# EAGLE schematic HoverBoard_SCHEMATIC_for_TAOTAO TT-SD2.2 (EAGLE 9.3.2)

## Sheet 1 of 4
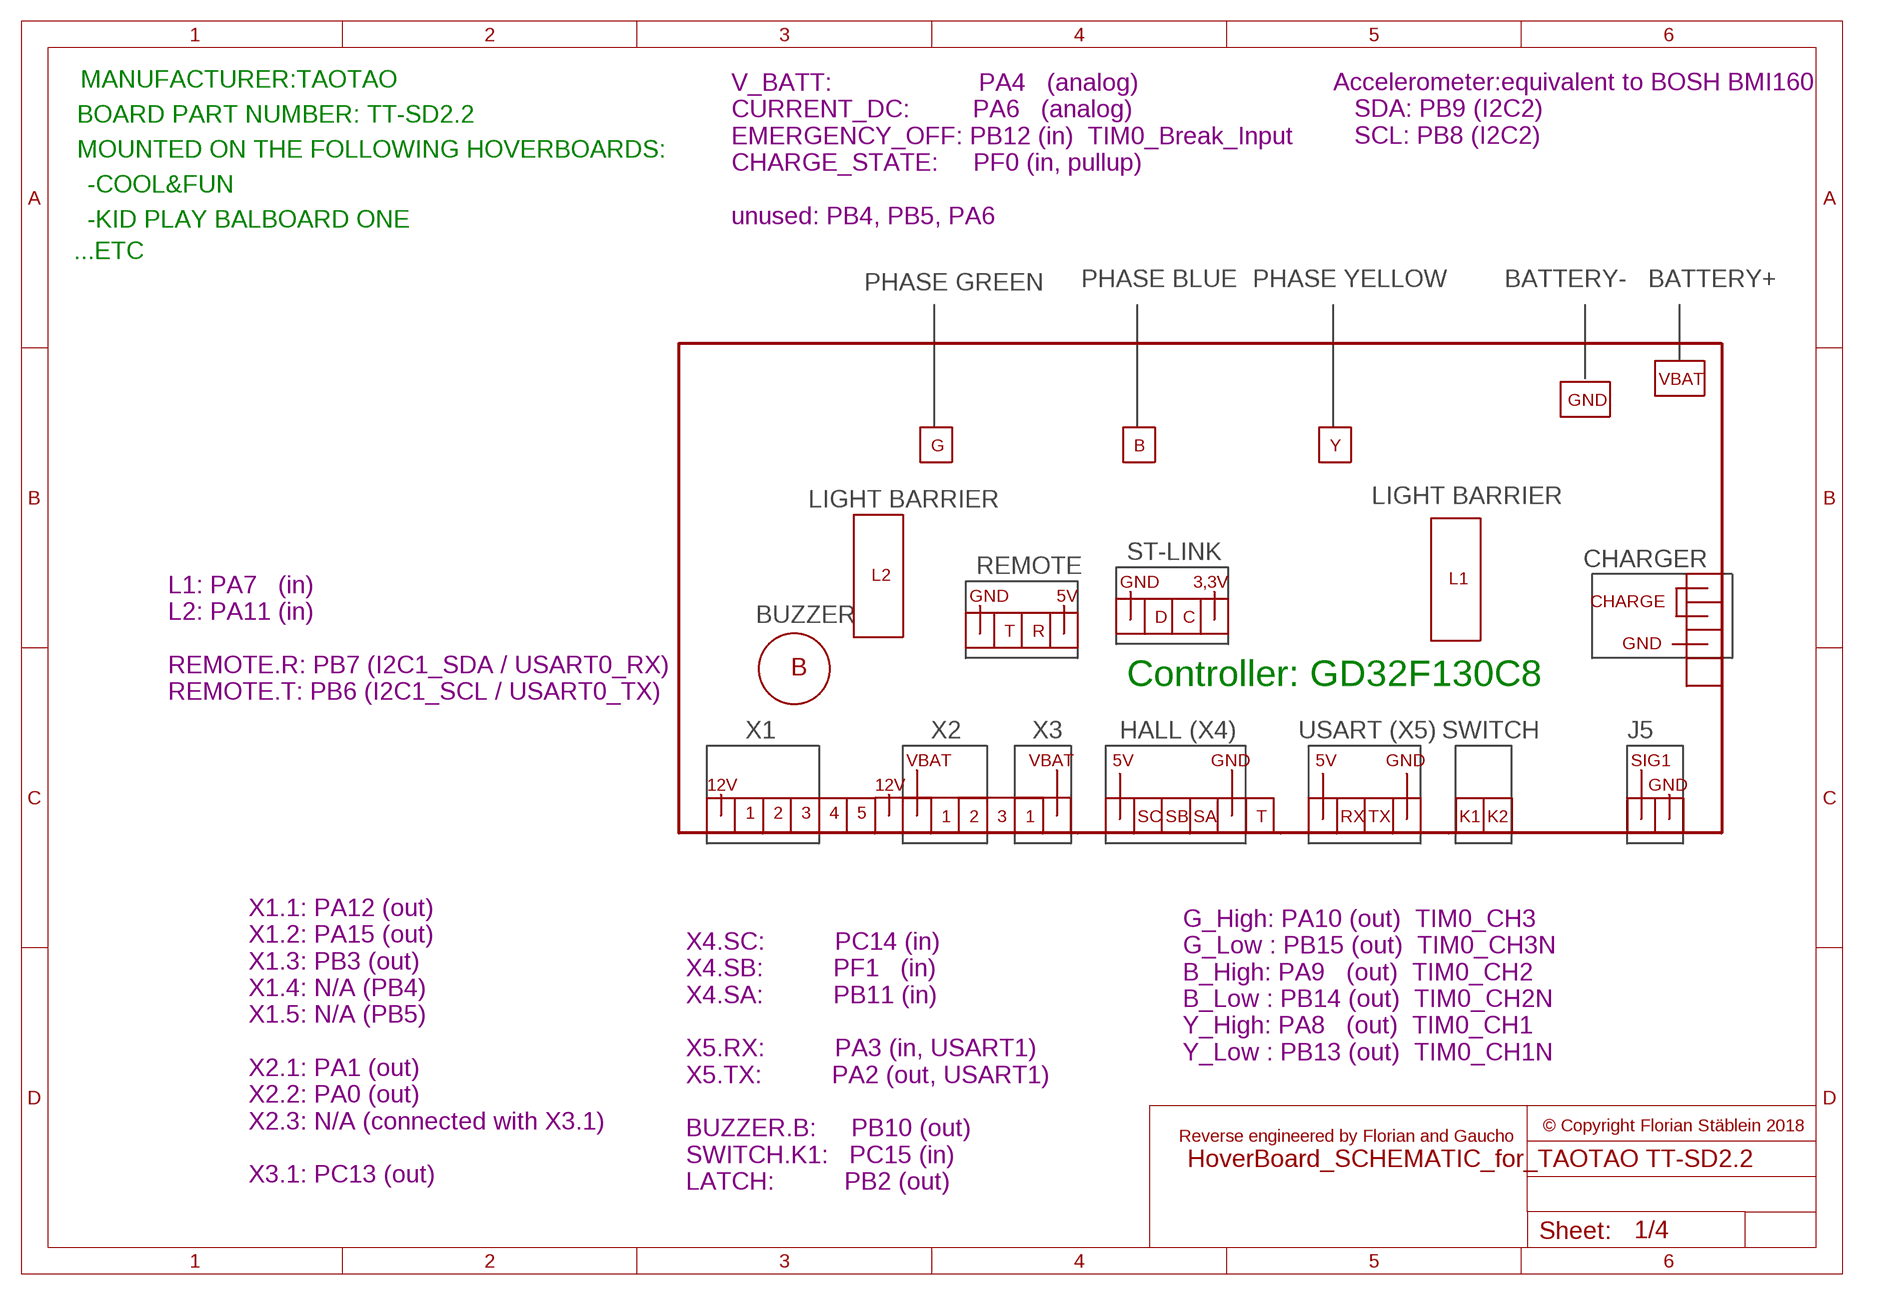
[diagram p0: schematic, sheet 1]

### Notes on the sheet
- MANUFACTURER:TAOTAO
- BOARD PART NUMBER: TT-SD2.2
- Accelerometer:equivalent to BOSH BMI160
     SDA: PB9 (I2C2)
     SCL: PB8 (I2C2)
- MOUNTED ON THE FOLLOWING HOVERBOARDS:
- -COOL&FUN
- V_BATT:                     PA4   (analog)
  CURRENT_DC:         PA6   (analog)
  EMERGENCY_OFF: PB12 (in)  TIM0_Break_Input
  CHARGE_STATE:     PF0 (in, pullup)
  
  unused: PB4, PB5, PA6
- -KID PLAY BALBOARD ONE
- ...ETC
- PHASE GREEN | PHASE BLUE | PHASE YELLOW | BATTERY- | BATTERY+
- VBAT
- GND
- G | B | Y
- LIGHT BARRIER | LIGHT BARRIER
- CHARGER
- ST-LINK
- REMOTE
- L2 | L1
- GND | 3,3V
- CHARGE
- GND | 5V
- BUZZER | D | C
- T | R | GND
- B
- Controller: GD32F130C8
- L1: PA7   (in)
  L2: PA11 (in)
  
  REMOTE.R: PB7 (I2C1_SDA / USART0_RX)
  REMOTE.T: PB6 (I2C1_SCL / USART0_TX)
- X1 | X2 | X3 | HALL (X4) | USART (X5) | SWITCH | J5
- VBAT | VBAT | 5V | GND | 5V | GND | SIG1
- 12V | 12V | GND
- 1 | 2 | 3 | 4 | 5 | 1 | 2 | 3 | 1 | SC | SB | SA | T | RX | TX | K1 | K2
- G_High: PA10 (out)  TIM0_CH3
  G_Low : PB15 (out)  TIM0_CH3N
  B_High: PA9   (out)  TIM0_CH2
  B_Low : PB14 (out)  TIM0_CH2N
  Y_High: PA8   (out)  TIM0_CH1
  Y_Low : PB13 (out)  TIM0_CH1N
- © Copyright Florian Stäblein 2018
- Reverse engineered by Florian and Gaucho
- X1.1: PA12 (out)
  X1.2: PA15 (out)
  X1.3: PB3 (out)
  X1.4: N/A (PB4)
  X1.5: N/A (PB5)
  
  X2.1: PA1 (out)
  X2.2: PA0 (out)
  X2.3: N/A (connected with X3.1)
  
  X3.1: PC13 (out)
- X4.SC:          PC14 (in)
  X4.SB:          PF1   (in)
  X4.SA:          PB11 (in)
  
  X5.RX:          PA3 (in, USART1)
  X5.TX:          PA2 (out, USART1)
  
  BUZZER.B:     PB10 (out)
  SWITCH.K1:   PC15 (in)
  LATCH:          PB2 (out)

## Sheet 2 of 4
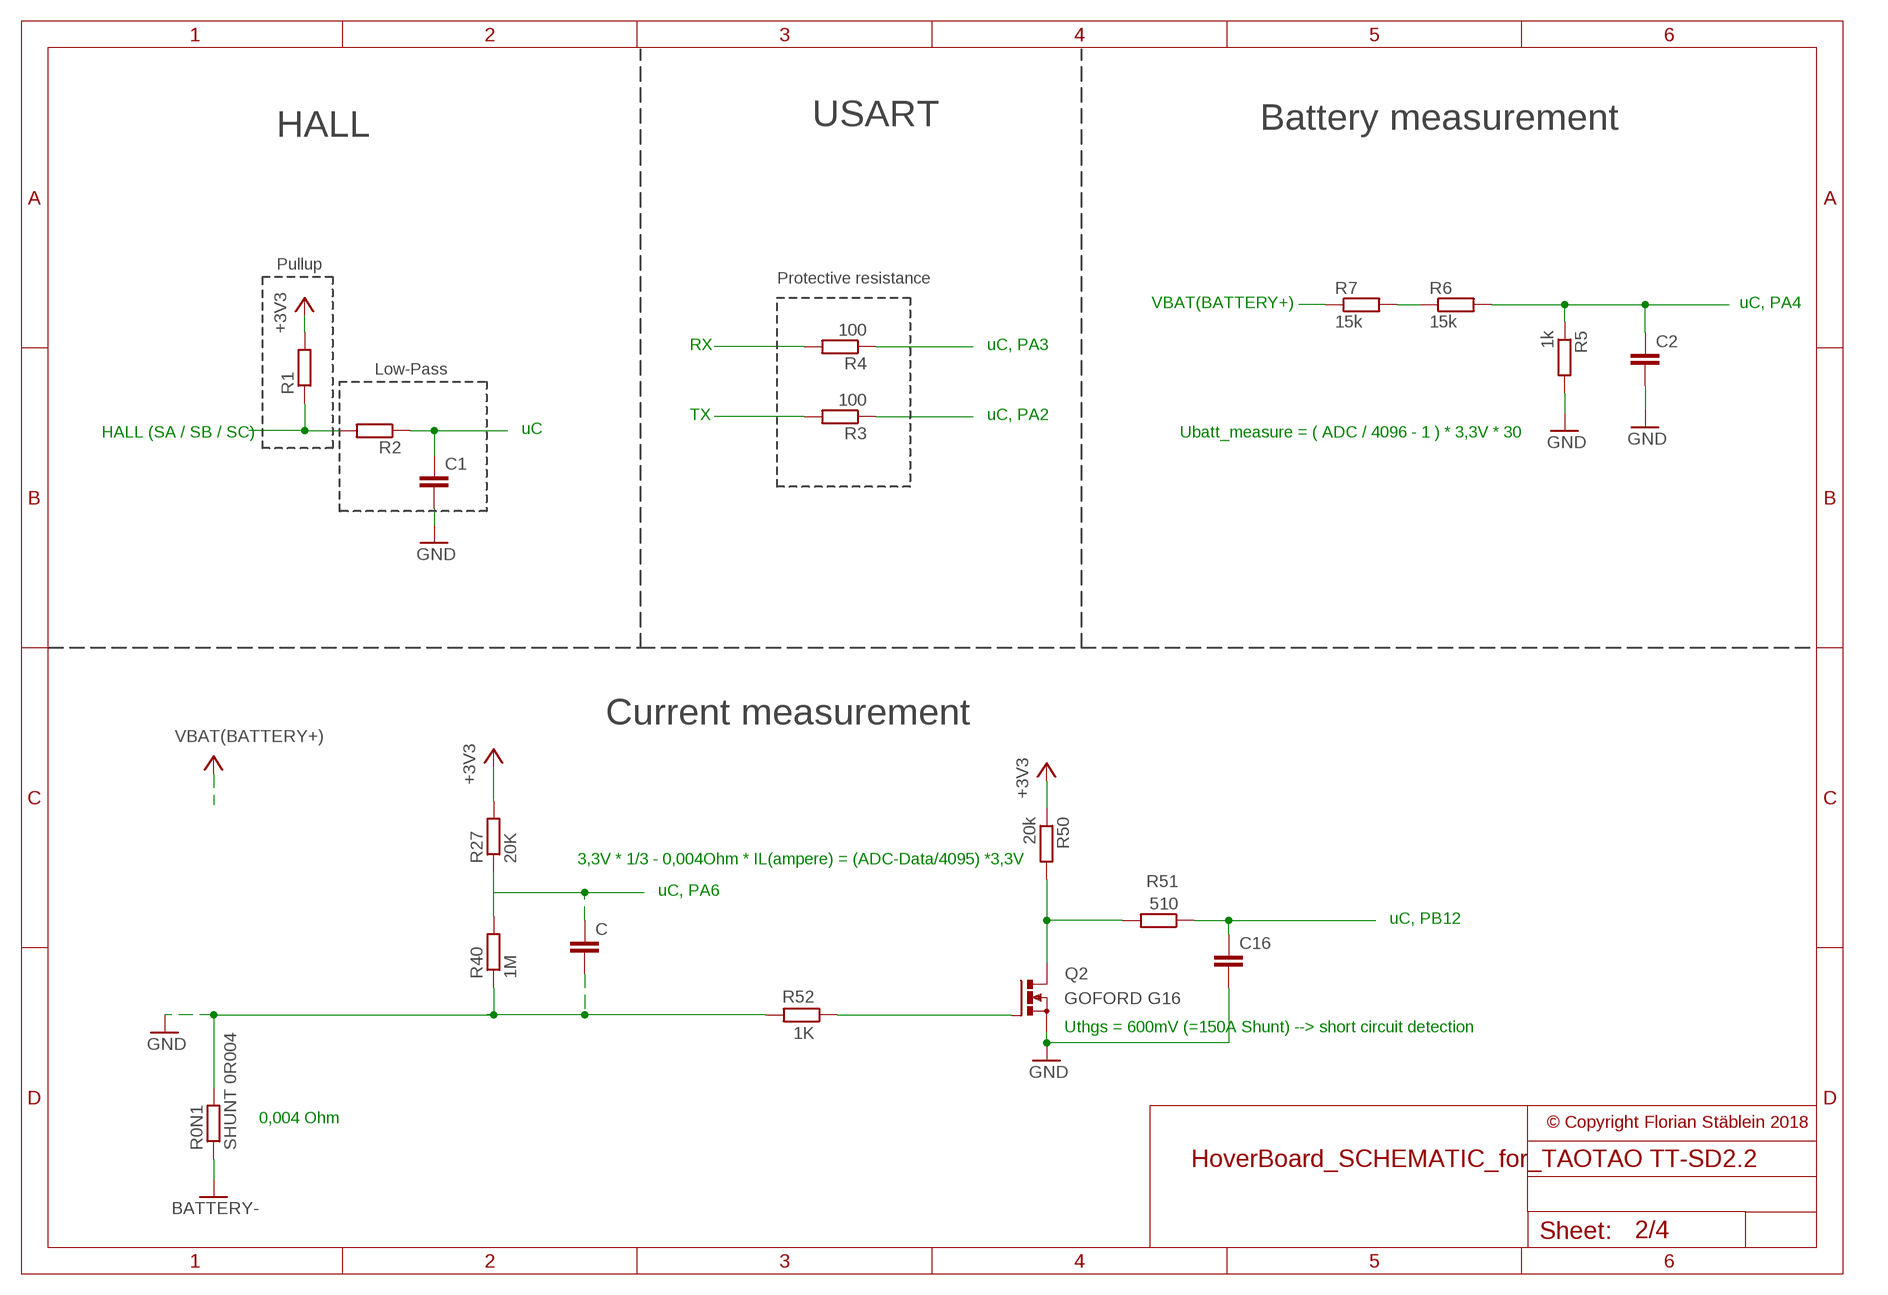
[diagram p1: schematic, sheet 2]
Q2 (N-MOSFET_SYMBOL): MDOEL: GOFORD G16

### Parts
C  C-EU025-025X050  [C025-025X050]
C1  C-EU025-025X050  [C025-025X050]
C2  C-EU025-025X050  [C025-025X050]
C16  C-EU025-025X050  [C025-025X050]
R0N1  SHUNT 0R004  R-EU_0207/2V  [0207/2V]
R1  R-EU_0207/2V  [0207/2V]
R2  R-EU_0207/2V  [0207/2V]
R3  100  R-EU_0207/2V  [0207/2V]
R4  100  R-EU_0207/2V  [0207/2V]
R5  1k  R-EU_0207/2V  [0207/2V]
R6  15k  R-EU_0207/2V  [0207/2V]
R7  15k  R-EU_0207/2V  [0207/2V]
R27  20K  R-EU_0207/2V  [0207/2V]
R40  1M  R-EU_0207/2V  [0207/2V]
R50  20k  R-EU_0207/2V  [0207/2V]
R51  510  R-EU_0207/2V  [0207/2V]
R52  1K  R-EU_0207/2V  [0207/2V]

### Nets
+3V3: R1.2 R27.2 R50.1 ; also sheet 3,4
GND: C1.2 C2.2 C16.2 R0N1.1 R0N1.2 R5.2 R40.1 ; also sheet 3,4
N$1: R1.1 R2.2
N$2: C1.1 R2.1
N$3: R4.2
N$4: R4.1
N$5: R3.2
N$6: R3.1
N$7: R7.1
N$8: R6.1 R7.2
N$9: C2.1 R5.1 R6.2
N$10: C.2 R52.2
N$12: R50.2 R51.2
N$13: C16.1 R51.1
N$48: R40.2
N$49: C.1 R27.1
N$62: R52.1

### Notes on the sheet
- HALL | USART | Battery measurement
- Pullup
- Protective resistance
- VBAT(BATTERY+) | uC, PA4
- RX | uC, PA3
- Low-Pass
- TX | uC, PA2
- HALL (SA / SB / SC) | uC | Ubatt_measure = ( ADC / 4096 - 1 ) * 3,3V * 30
- Current measurement
- 3,3V * 1/3 - 0,004Ohm * IL(ampere) = (ADC-Data/4095) *3,3V
- uC, PA6
- uC, PB12
- Uthgs = 600mV (=150A Shunt) --> short circuit detection
- 0,004 Ohm
- © Copyright Florian Stäblein 2018

## Sheet 3 of 4
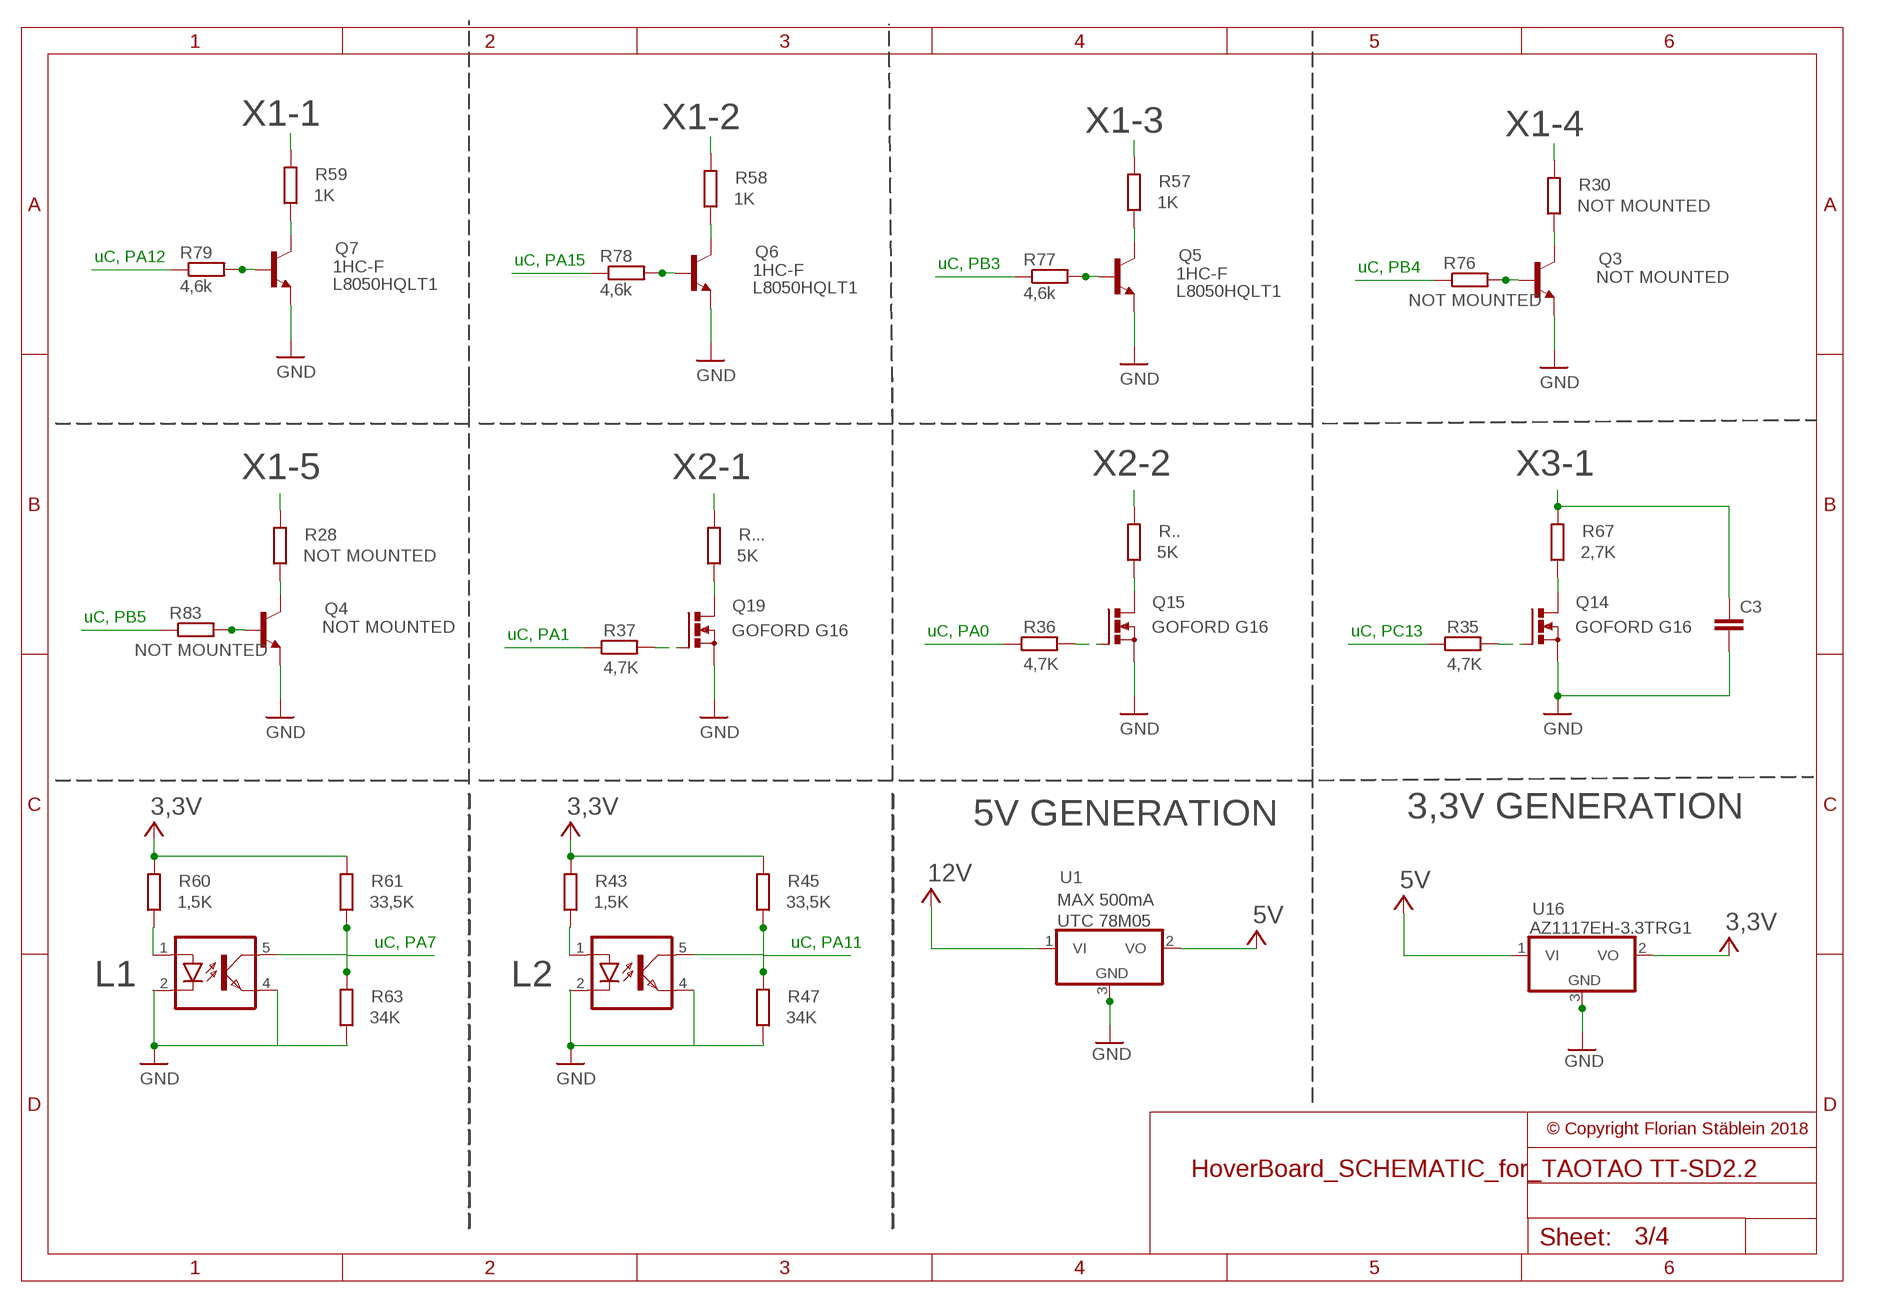
[diagram p2: schematic, sheet 3]
Q14 (N-MOSFET_SYMBOL): MDOEL: GOFORD G16
Q15 (N-MOSFET_SYMBOL): MDOEL: GOFORD G16
Q19 (N-MOSFET_SYMBOL): MDOEL: GOFORD G16

### Parts
C3  C-EU025-025X050  [C025-025X050]
L  CNY17F  [DIL06]
L1  CNY17F  [DIL06]
Q3  BC849  [SOT23]
Q4  BC849  [SOT23]
Q5  BC849  [SOT23]
Q6  BC849  [SOT23]
Q7  BC849  [SOT23]
R28  NOT MOUNTED  R-EU_0207/2V  [0207/2V]
R30  NOT MOUNTED  R-EU_0207/2V  [0207/2V]
R35  4,7K  R-EU_0207/2V  [0207/2V]
R36  4,7K  R-EU_0207/2V  [0207/2V]
R37  4,7K  R-EU_0207/2V  [0207/2V]
R43  1,5K  R-EU_0207/2V  [0207/2V]
R45  33,5K  R-EU_0207/2V  [0207/2V]
R47  34K  R-EU_0207/2V  [0207/2V]
R57  1K  R-EU_0207/2V  [0207/2V]
R58  1K  R-EU_0207/2V  [0207/2V]
R59  1K  R-EU_0207/2V  [0207/2V]
R60  1,5K  R-EU_0207/2V  [0207/2V]
R61  33,5K  R-EU_0207/2V  [0207/2V]
R63  34K  R-EU_0207/2V  [0207/2V]
R67  2,7K  R-EU_0207/2V  [0207/2V]
R76  NOT MOUNTED  R-EU_0207/2V  [0207/2V]
R77  4,6k  R-EU_0207/2V  [0207/2V]
R78  4,6k  R-EU_0207/2V  [0207/2V]
R79  4,6k  R-EU_0207/2V  [0207/2V]
R83  NOT MOUNTED  R-EU_0207/2V  [0207/2V]
R..  5K  R-EU_0207/2V  [0207/2V]
R...  5K  R-EU_0207/2V  [0207/2V]
U1  7805DT  [TO252]
U16  7805DT  [TO252]

### Nets
+3V3: R43.2 R45.2 R60.2 R61.2 U1.1(VI) U1.2(VO) U16.1(VI) U16.2(VO) ; also sheet 2,4
GND: C3.2 L1.2(C) L1.4(EMIT) L.2(C) L.4(EMIT) R47.1 R63.1 U1.3(GND) U16.3(GND) ; also sheet 2,4
N$11: R....1
N$14: R59.1
N$15: R79.1
N$16: R58.1
N$17: Q6.1(B) R78.2
N$18: R78.1
N$19: R57.1
N$20: L.1(A) R60.1
N$21: R59.2
N$22: R58.2
N$23: Q7.1(B) R79.2
N$24: Q5.1(B) R77.2
N$25: R77.1
N$26: R30.1
N$27: Q3.1(B) R76.2
N$28: R76.1
N$29: R28.1
N$30: Q4.1(B) R83.2
N$31: R83.1
N$32: R57.2
N$33: R30.2
N$34: R28.2
N$35: L.5(COL) R61.1 R63.2
N$36: L1.1(A) R43.1
N$37: L1.5(COL) R45.1 R47.2
N$50: R37.2
N$51: R37.1
N$52: R....2
N$53: R...1
N$54: R...2
N$55: R36.1
N$56: R36.2
N$57: R67.1
N$58: C3.1 R67.2
N$59: R35.1
N$60: R35.2
Unconnected: Q3.2(E) Q3.3(C) Q4.2(E) Q4.3(C) Q5.2(E) Q5.3(C) Q6.2(E) Q6.3(C) Q7.2(E) Q7.3(C)

### Notes on the sheet
- X1-1 | X1-2 | X1-3 | X1-4
- uC, PA12 | uC, PA15
- uC, PB3 | uC, PB4
- X1-5 | X2-1 | X2-2 | X3-1
- uC, PB5
- uC, PA1 | uC, PA0 | uC, PC13
- 3,3V | 3,3V | 3,3V GENERATION
- 5V GENERATION
- 12V | 5V
- 5V | 3,3V
- uC, PA7 | uC, PA11
- L1 | L2
- © Copyright Florian Stäblein 2018

## Sheet 4 of 4
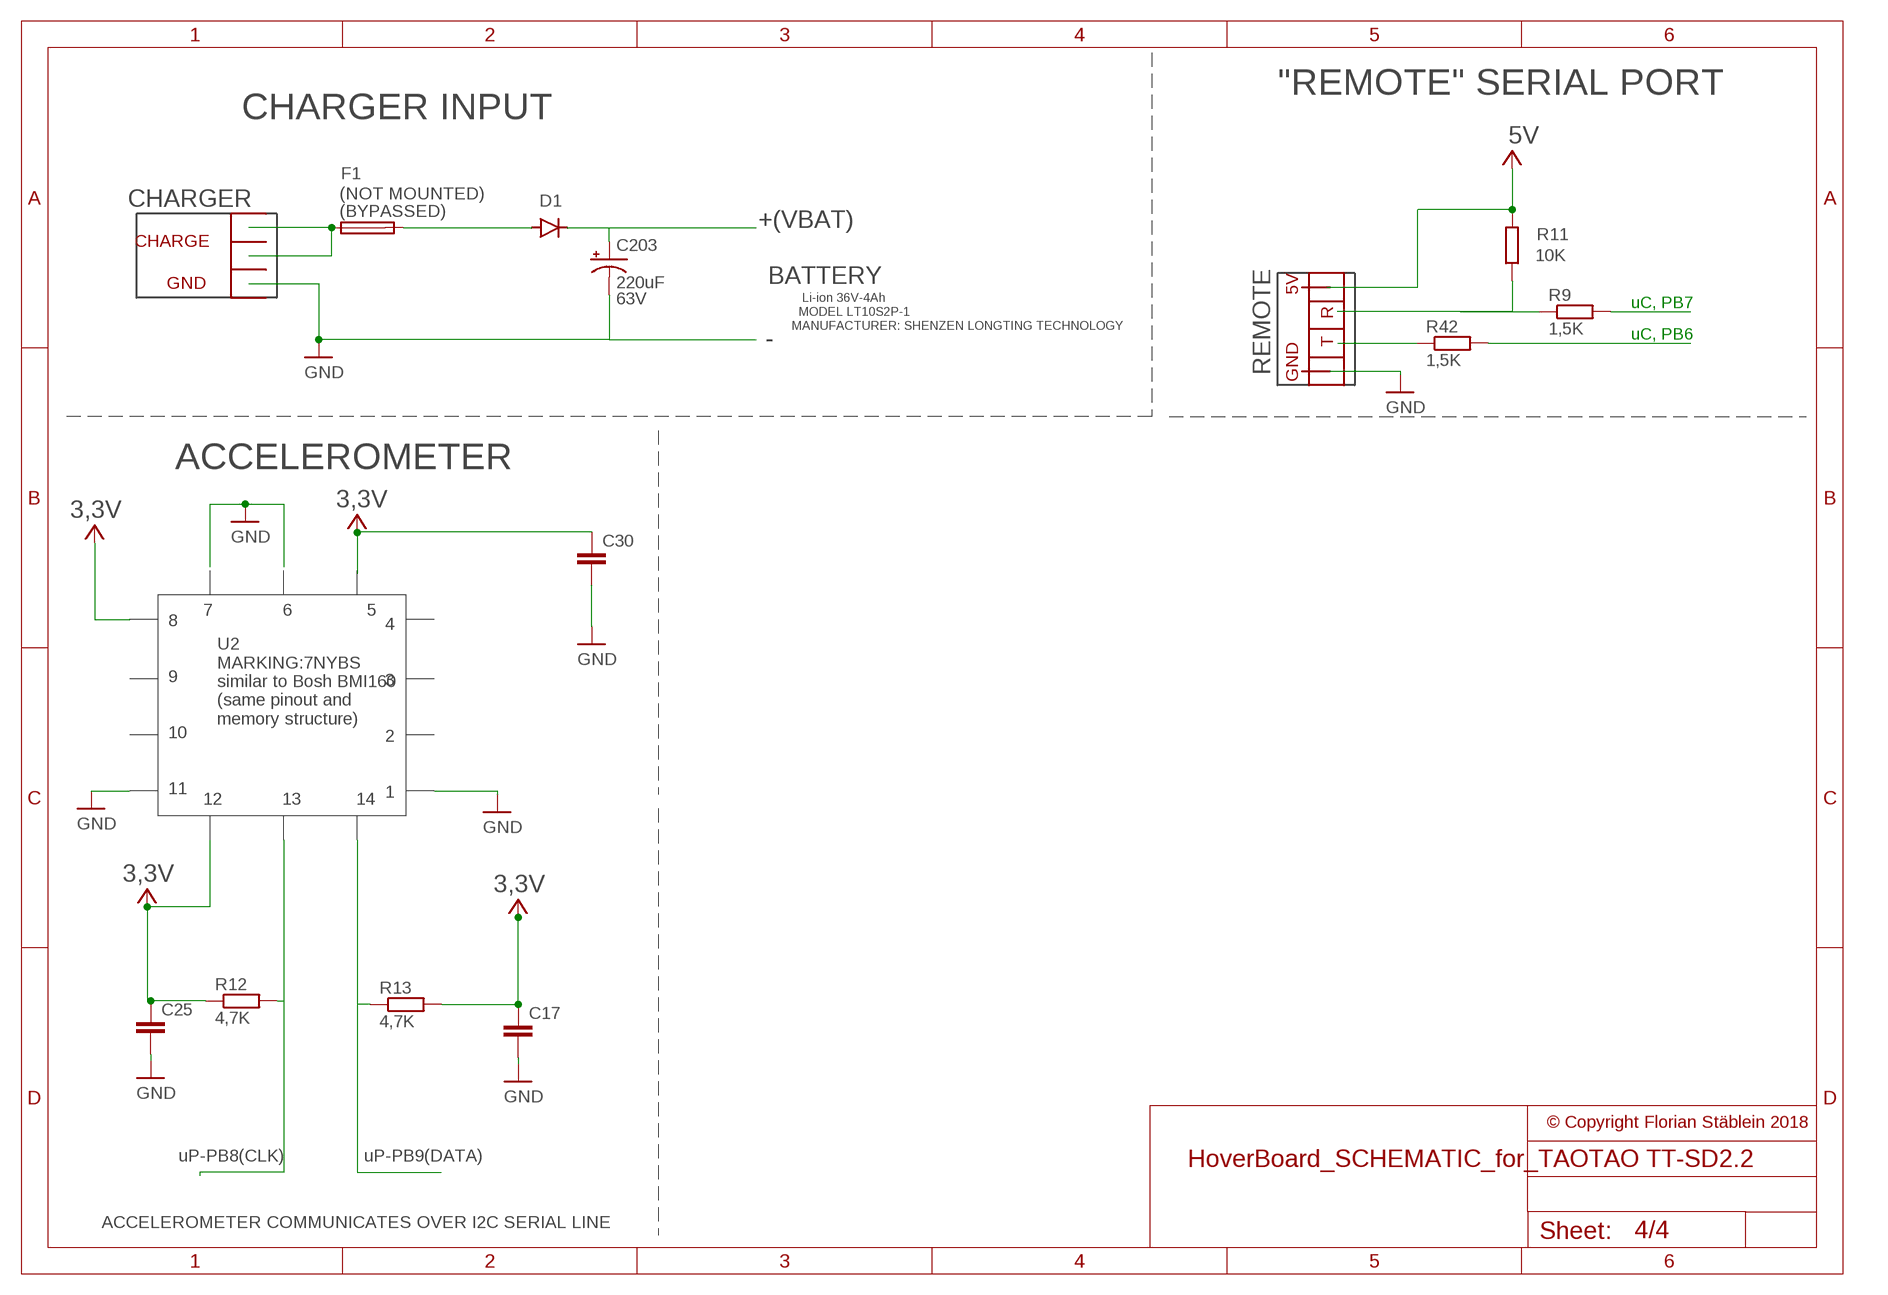
[diagram p3: schematic, sheet 4]

### Parts
C17  C-EU025-025X050  [C025-025X050]
C25  C-EU025-025X050  [C025-025X050]
C30  C-EU025-025X050  [C025-025X050]
C203  220uF  CPOL-USB45181B  [B45181B]
D1  ES2D  [SMB]
F1  19559  [19559]
R9  1,5K  R-EU_0207/2V  [0207/2V]
R11  10K  R-EU_0207/2V  [0207/2V]
R12  4,7K  R-EU_0207/2V  [0207/2V]
R13  4,7K  R-EU_0207/2V  [0207/2V]
R42  1,5K  R-EU_0207/2V  [0207/2V]

### Nets
+3V3: C17.1 C25.1 C30.1 R11.2 R12.1 R13.2 ; also sheet 2,3
GND: C17.2 C25.2 C30.2 C203.- ; also sheet 2,3
N$38: F1.1
N$39: D1.A F1.2
N$40: C203.+ D1.C
N$42: R9.2
N$43: R9.1
N$44: R11.1
N$45: R42.1
N$46: R42.2
N$61: R12.2
N$63: R13.1

### Notes on the sheet
- "REMOTE" SERIAL PORT
- CHARGER INPUT
- 5V
- CHARGER
- +(VBAT)
- CHARGE
- BATTERY
- GND
- Li-ion 36V-4Ah | 5V
- MODEL LT10S2P-1 | uC, PB7
- R
- - | MANUFACTURER: SHENZEN LONGTING TECHNOLOGY
- uC, PB6
- T
- REMOTE
- GND
- ACCELEROMETER
- 3,3V
- 3,3V
- 7              6               5
- U2
  MARKING:7NYBS
  similar to Bosh BMI160
  (same pinout and 
  memory structure)
- 8
  
  
  9
  
  
  10
  
  
  11
- 4
  
  
  3
  
  
  2
  
  
  1
- 12            13           14
- 3,3V
- 3,3V
- © Copyright Florian Stäblein 2018
- uP-PB8(CLK) | uP-PB9(DATA)
- ACCELEROMETER COMMUNICATES OVER I2C SERIAL LINE

## Library data of the parts
C C1-C3 C16 C17 C25 C30 = rcl:C-EU: CAPACITOR, European symbol
C203 = adafruit:CPOL-US: POLARIZED CAPACITOR, American symbol; VOLTAGE: 63V
D1 = diode:ES2D: DIODE super fast rectifier, 2 A
F1 = fuse:19559: FUSE HOLDER TR5, Wickmann; BYPASSED: (BYPASSED); MPN: 55900000001; NOTMOUNTED: (NOT MOUNTED); OC_FARNELL: 9516360; OC_NEWARK: 02P0286
L L1 = optocoupler:CNY17F: SIEMENS OPTO COUPLER; MF: VISHAY/TELEFUNKEN; MPN: CNY17F-3; OC_FARNELL: 1469473; OC_NEWARK: 58K0172
Q3 Q4 = transistor:BC849: NPN TRANSISTOR; MARKING: NOT MOUNTED; MODEL: L8050HQLT1
Q5-Q7 = transistor:BC849: NPN TRANSISTOR; MARKING: 1HC-F; MODEL: L8050HQLT1
R0N1 R1-R7 R9 R11-R13 R27 R28 R30 R35-R37 R40 R42 R43 R45 R47 R50-R52 R57-R61 R63 R67 R76-R79 R83 R.. R... = rcl:R-EU_: RESISTOR, European symbol
U1 = adafruit:78*: Positive VOLTAGE REGULATOR Added bigger pads to the TO-92 package; MAXCURRENT: MAX 500mA; MODEL: UTC 78M05
U16 = adafruit:78*: Positive VOLTAGE REGULATOR Added bigger pads to the TO-92 package; MODEL: AZ1117EH-3.3TRG1